# Altium project XBeeLight.PrjPcb
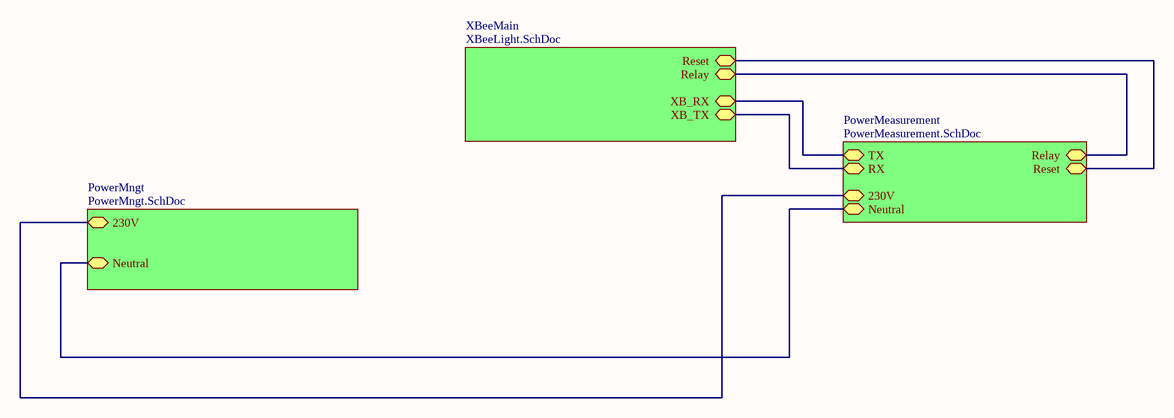
[diagram p0: XBeeCct.SchDoc]
4 sheets, 81 parts. Net scope: hierarchical (ports join the sheet entries above them; power ports are global).
Board file: XBeePCB.PcbDoc
Sheets:
  XBeeCct.SchDoc
    XBeeMain = XBeeLight.SchDoc
    PowerMngt = PowerMngt.SchDoc
    PowerMeasurement = PowerMeasurement.SchDoc

## Sheet XBeeCct.SchDoc
size A

### Sub-sheets
PowerMeasurement = PowerMeasurement.SchDoc: TX, RX, Relay, Reset, 230V, Neutral
PowerMngt = PowerMngt.SchDoc: 230V, Neutral
XBeeMain = XBeeLight.SchDoc: XB_TX, XB_RX, Reset, Relay

### Nets
230V: sheet PowerMngt/230V, sheet PowerMeasurement/230V
Neutral: sheet PowerMngt/Neutral, sheet PowerMeasurement/Neutral
Relay: sheet XBeeMain/Relay, sheet PowerMeasurement/Relay
Reset: sheet XBeeMain/Reset, sheet PowerMeasurement/Reset
RX: sheet XBeeMain/XB_TX, sheet PowerMeasurement/RX
TX: sheet XBeeMain/XB_RX, sheet PowerMeasurement/TX

## Sheet XBeeLight.SchDoc
size A4
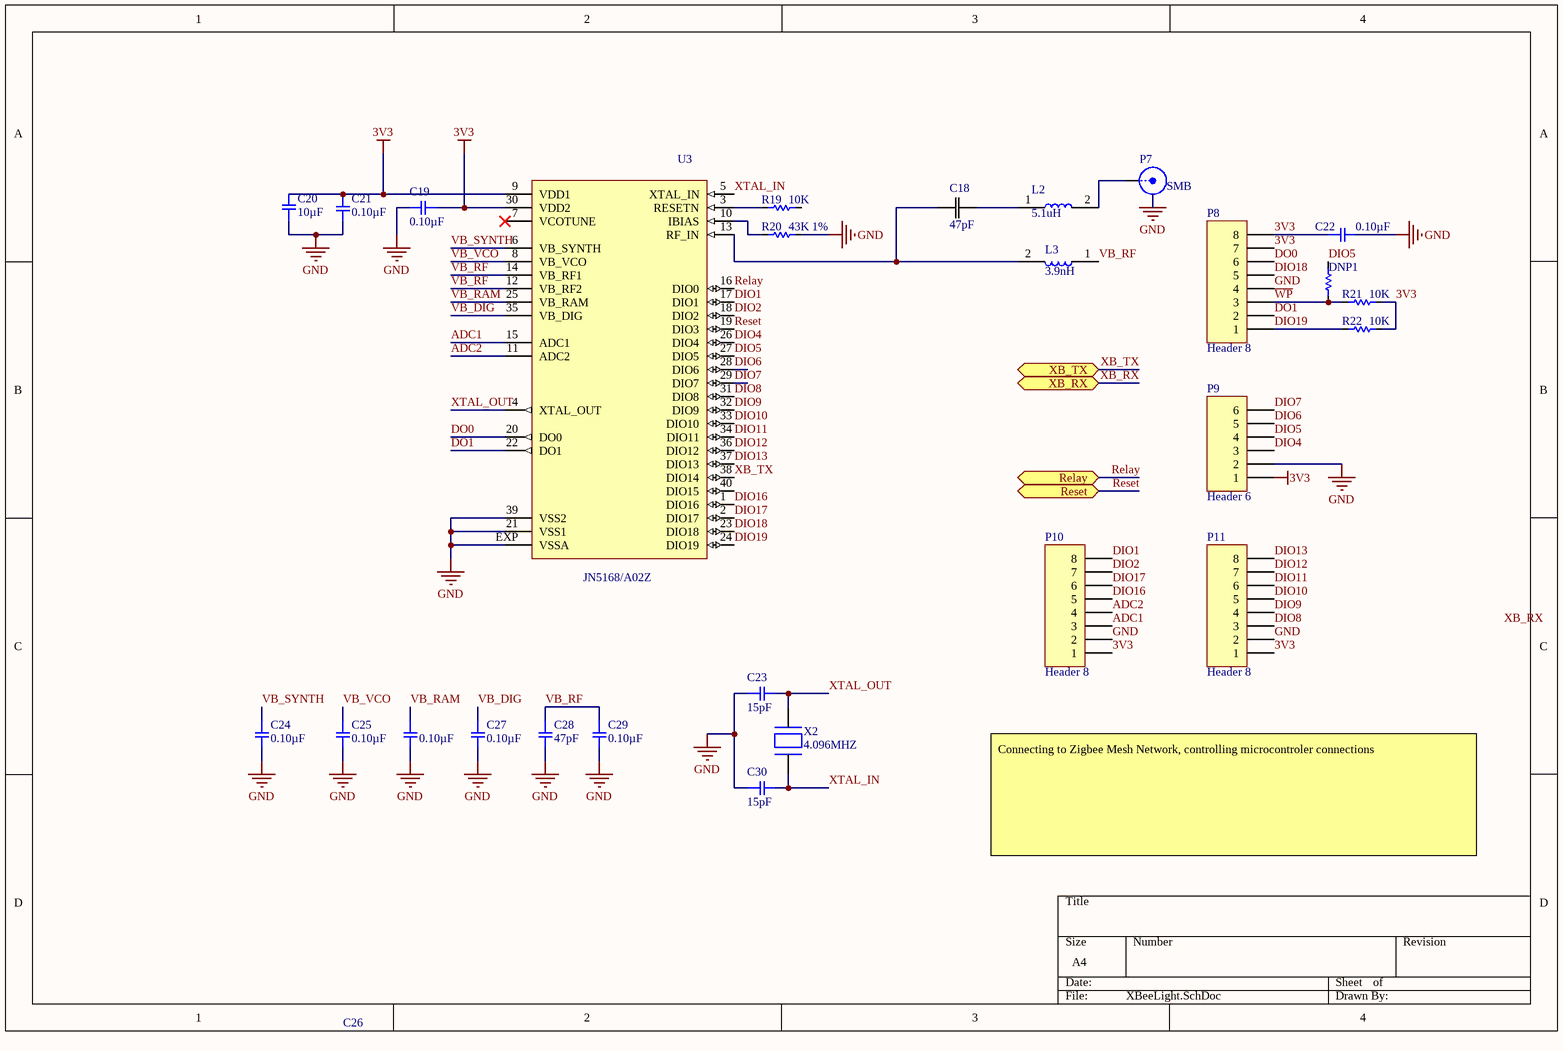
[diagram p1: XBeeLight.SchDoc]

### Parts
C18  47pF  [CC0402N]
C19  0.10µF  [SMD-0402C]
C20  10µF  [SMD-0603C]
C21  0.10µF  [SMD-0402C]
C22  0.10µF  [SMD-0402C]
C23  15pF  [SMD-0402C]
C24  0.10µF  [SMD-0402C]
C25  0.10µF  [SMD-0402C]
C26  0.10µF  [SMD-0402C]
C27  0.10µF  [SMD-0402C]
C28  47pF  [SMD-0402C]
C29  0.10µF  [SMD-0402C]
C30  15pF  [SMD-0402C]
DNP1  10K  [MCS 0402]  (value not drawn)
L2  5.1uH  [INDC1005X45]
L3  3.9nH  [INDC1005X45]
P7  SMB  [SMB_V-RJ45]
P8  Header 8  [HDR1X8]
P9  Header 6  [HDR1X6]
P10  Header 8  [HDR1X8]
P11  Header 8  [HDR1X8]
R19  10K  [MCS 0402]
R20  43K 1%  [RC0402N]
R21  10K  [MCS 0402]
R22  10K  [MCS 0402]
U3  JN5168/A02Z  [QFN50P600X600X100-41N_JN5168/A02Z(Primary)]
X2  4.096MHZ  [XTAL_ABLS2-4.096MHZ-D4Y-T]

### Ports
Relay (bidir), Reset (bidir), XB_RX (bidir), XB_TX (bidir)

### Nets
3V3: C19.1 C20.2 C21.1 C22.1 P8.7 P8.8 P9.1 P10.1 P11.1 R21.2 R22.2 U3.9(VDD1) U3.30(VDD2)
GND: C19.2 C20.1 C21.2 C22.2 C23.1 C24.2 C25.2 C26.2 C27.2 C28.2 C29.2 C30.1 P7.2(Y) P8.4 P9.2 P10.2 P11.2 R20.2 U3.21(VSS1) U3.39(VSS2) U3.EXP(VSSA)
ADC1: P10.3 U3.15(ADC1)
ADC2: P10.4 U3.11(ADC2)
DIO1: P10.8 U3.17(DIO1)
DIO2: P10.7 U3.18(DIO2)
DIO4: P9.3 U3.26(DIO4)
DIO5: DNP1.2 P9.4 U3.27(DIO5)
DIO6: P9.5 U3.28(DIO6)
DIO7: P9.6 U3.29(DIO7)
DIO8: P11.3 U3.31(DIO8)
DIO9: P11.4 U3.32(DIO9)
DIO10: P11.5 U3.33(DIO10)
DIO11: P11.6 U3.34(DIO11)
DIO12: P11.7 U3.36(DIO12)
DIO13: P11.8 U3.37(DIO13)
DIO16: P10.5 U3.1(DIO16)
DIO17: P10.6 U3.2(DIO17)
DIO18: P8.5 U3.23(DIO18)
DIO19: P8.1 R22.1 U3.24(DIO19)
DO0: P8.6 U3.20(DO0)
DO1: P8.2 U3.22(DO1)
Relay: U3.16(DIO0) ; port Relay
Reset: U3.19(DIO3) ; port Reset
VB_DIG: C27.1 U3.35(VB_DIG)
VB_RAM: C26.1 U3.25(VB_RAM)
VB_RF: C28.1 C29.1 L3.1 U3.12(VB_RF2) U3.14(VB_RF1)
VB_SYNTH: C24.1 U3.6(VB_SYNTH)
VB_VCO: C25.1 U3.8(VB_VCO)
~{WP}: DNP1.1 P8.3 R21.1
XB_TX: U3.38(DIO14) ; port XB_TX  [project net RX]
XTAL_IN: C30.2 U3.5(XTAL_IN) X2.1
XTAL_OUT: C23.2 U3.4(XTAL_OUT) X2.2
NetC18_1: C18.1 L2.1
NetC18_2: C18.2 L3.2 U3.13(RF_IN)
NetL2_2: L2.2 P7.1(X)
NetR19_1: R19.1 U3.3(RESETN)
NetR20_1: R20.1 U3.10(IBIAS)

Not connected (* = marked no-connect by the designer): R19 2; U3 7(VCOTUNE)* 40(DIO15)

### Notes on the sheet
- Connecting to Zigbee Mesh Network, controlling microcontroler connections
- Labels drawn without touching a wire or pin: XB_RX

### Library data of the parts
C18 = CC0402JRNPO9BN47: Imported; Manufacturer_Part_Number: CC0402JRNPO9BN470; Vendor: Yageo; Built_By: EMA_UL_Team; Type: DEV; C: Copyright (C) 2015 Accelerated Designs. All rights reserved; RefDes: RefDes; Value: Value
C19 C21 C22 C24-C27 C29 = GCM155R71C104KA55D: CAP CER 0.1UF 16V X7R 0402; Manufacturer: Murata Electronics North America; Factory Stock: 0; Unit Price (USD): 0.1; Minimum Quantity: 1; Tolerance: ±10%; Datasheets: http://www.murata.com/~/media/webrenewal/support/library/catalog/products/capacitor/mlcc/c03e.ashx; Image: //media.digikey.com/Renders/Murata%20Renders/ZRB-SERIES-0402.jpg; Digi-Key Part Number: 490-4759-1-ND; Part Number: GCM155R71C104KA55D; Quantity Available: 734194; @ qty: 0; Packaging: Cut Tape (CT); Series: GCM; Part Status: Active; Value: 0.10µF; Voltage: 16V; Temperature Coefficient: X7R; Operating Temperature: -55°C ~ 125°C; Features: -; Ratings: AEC-Q200; Applications: Automotive; Mounting Type: Surface Mount, MLCC; Package / Case: 0402 (1005 Metric); Size / Dimension: 0.039" L x 0.020" W (1.00mm x 0.50mm); Height - Seated (Max): -; Thickness (Max): 0.022" (0.55mm); Lead Spacing: -; Lead Style: -
C20 = GRM188R60J106KE47D: CAP CER 10UF 6.3V X5R 0603; Manufacturer: Murata Electronics North America; Factory Stock: 0; Unit Price (USD): 0.13; Minimum Quantity: 1; Tolerance: ±10%; Datasheets: http://www.murata.com/~/media/webrenewal/support/library/catalog/products/capacitor/mlcc/c02e.pdf; Image: //media.digikey.com/Renders/Murata%20Renders/ZRB-SERIES-0402.jpg; Digi-Key Part Number: 490-12538-1-ND; Part Number: GRM188R60J106KE47D; Quantity Available: 3805; @ qty: 0; Packaging: Cut Tape (CT); Series: GRM; Part Status: Active; Value: 10µF; Voltage: 6.3V; Temperature Coefficient: X5R; Operating Temperature: -55°C ~ 85°C; Features: -; Ratings: -; Applications: General Purpose; Mounting Type: Surface Mount, MLCC; Package / Case: 0603 (1608 Metric); Size / Dimension: 0.063" L x 0.031" W (1.60mm x 0.80mm); Height - Seated (Max): -; Thickness (Max): 0.035" (0.90mm); Lead Spacing: -; Lead Style: -
C23 C30 = GJM1555C1H150FB01D: CAP CER 15PF 50V NP0 0402; Manufacturer: Murata Electronics North America; Factory Stock: 0; Unit Price (USD): 0.21; Minimum Quantity: 1; Tolerance: ±1%; Temperature Coefficient: C0G, NP0; Datasheets: http://www.murata.com/~/media/webrenewal/support/library/catalog/products/capacitor/mlcc/c02e.pdf; Image: //media.digikey.com/Renders/Murata%20Renders/ZRB-SERIES-0402.jpg; Digi-Key Part Number: 490-11191-1-ND; Part Number: GJM1555C1H150FB01D; Quantity Available: 36038; @ qty: 0; Packaging: Cut Tape (CT); Series: GJM; Part Status: Active; Value: 15pF; Voltage: 50V; Operating Temperature: -55°C ~ 125°C; Features: High Q, Low Loss; Ratings: -; Applications: RF, Microwave, High Frequency; Mounting Type: Surface Mount, MLCC; Package / Case: 0402 (1005 Metric); Size / Dimension: 0.039" L x 0.020" W (1.00mm x 0.50mm); Height - Seated (Max): -; Thickness (Max): 0.022" (0.55mm); Lead Spacing: -; Lead Style: -
C28 = GCM1555C1H470JA16D: CAP CER 47PF 50V NP0 0402; Manufacturer: Murata Electronics North America; Factory Stock: 0; Unit Price (USD): 0.1; Minimum Quantity: 1; Tolerance: ±5%; Temperature Coefficient: C0G, NP0; Datasheets: http://www.murata.com/~/media/webrenewal/support/library/catalog/products/capacitor/mlcc/c03e.ashx; Image: //media.digikey.com/Renders/Murata%20Renders/ZRB-SERIES-0402.jpg; Digi-Key Part Number: 490-10670-1-ND; Part Number: GCM1555C1H470JA16D; Quantity Available: 171; @ qty: 0; Packaging: Cut Tape (CT); Series: GCM; Part Status: Active; Value: 47pF; Voltage: 50V; Operating Temperature: -55°C ~ 125°C; Features: -; Ratings: AEC-Q200; Applications: Automotive; Mounting Type: Surface Mount, MLCC; Package / Case: 0402 (1005 Metric); Size / Dimension: 0.039" L x 0.020" W (1.00mm x 0.50mm); Height - Seated (Max): -; Thickness (Max): 0.022" (0.55mm); Lead Spacing: -; Lead Style: -
DNP1 R19 R21 R22 = 10K Res: Res Thin Film 0402 10K Ohm 0.5% 0.063W(1/16W) ±25ppm/C Molded SMD Automotive Punched T/R; Manufacturer: Panasonic; Manufacturer Part Number: ERA-2AED103X; Resistance: 10 kO; Temp Coefficient: ±25 ppm/°C; Supplier 1: Digi-Key; Stock 1: 99513; Pricing 1: 1=0.22, 10=0.188, 100=0.0735, 1000=0.0308, 2500=0.0282, 5000=0.0256 (USD); Rated Power: 0.063 W; Size Code: 0402; Tolerance (%): ±0.5 %; ComponentLink1URL: https://datasheet.ciiva.com/43470/1776116-43470437.pdf; ComponentLink1Description: https://datasheet.ciiva.com/43470/1776116-43470437.pdf; ComponentLink2URL: https://datasheet.ciiva.com/7830/1776116-7830919.pdf; ComponentLink2Description: https://datasheet.ciiva.com/7830/1776116-7830919.pdf; ComponentLink3URL: https://datasheet.ciiva.com/30240/54aoa0000ce26-30240474.pdf; ComponentLink3Description: https://datasheet.ciiva.com/30240/54aoa0000ce26-30240474.pdf; ComponentLink4URL: https://datasheet.ciiva.com/46378/1776116-46378235.pdf; ComponentLink4Description: https://datasheet.ciiva.com/46378/1776116-46378235.pdf; Supplier Part Number 1: P10KDECT-ND
L2 = LQP15MN5N1B02D: Inductor RF Chip Unshielded Thin Film 5.1nH 0.1nH 500MHz 13Q-Factor Ceramic 140mA 700mOhm DCR 0402 T/R; MF: Murata; Package: 0402 Murata; Digi-Key_Part_Number: 490-6758-1-ND; Digi-Key_Purchase_URL: https://www.digikey.lk/product-detail/en/murata-electronics-north-america/LQP15MN5N1B02D/490-6758-1-ND/3845955?utm_source=snapeda&utm_medium=aggregator&utm_campaign=symbol; SnapEDA_Link: https://www.snapeda.com/parts/LQP15MN5N1B02D/Murata%20Electronics%20North%20America/view-part/?ref=snap; MP: LQP15MN5N1B02D; Value: *
L3 = LQP15MN3N9B02D: FIXED IND 3.9NH 170MA 500 MOHM; Manufacturer: Murata; Product Training Modules: Inductor Products Chip RF Inductors; Catalog Drawings: LQP15M Series Top LQP15M Series Side; Type: Thin Film; Material - Core: Non-Magnetic; Tolerance: ±0.1nH; Shielding: Unshielded; DC Resistance (DCR): 500 mOhm Max; Q @ Freq: 13 @ 500MHz; Frequency - Self Resonant: 6GHz; Frequency - Test: 500MHz; Online Catalog: LQP Series; Other Names: 490-1131-2 / LQP10A3N9B02T1; Supplier 1: Digi-Key; Manufacturer Part Number: LQP15MN3N9B02D; Stock 1: 110804; Pricing 1: 1=0.19, 10=0.173, 100=0.1152, 500=0.096, 1000=0.0807, 2500=0.0691 (USD); Standard Package: 10,000; Category: Inductors, Coils, Chokes; Family: Fixed Inductors; Series: LQP15M; Packaging: Tape & Reel (TR); Inductance: 3.9nH; Current Rating: 170mA; Operating Temperature: -40°C ~ 85°C; Mounting Type: Surface Mount; Package / Case: 0402 (1005 Metric); Size / Dimension: 0.039" L x 0.020" W (1.00mm x 0.50mm); Height - Seated (Max): 0.018" (0.45mm); ComponentLink1URL: http://search.murata.co.jp/Ceramy/image/img/PDF/ENG/L0075S0084LQP15M.pdf; ComponentLink1Description: http://search.murata.co.jp/Ceramy/image/img/PDF/ENG/L0075S0084LQP15M.pdf; ComponentLink2URL: https://www.murata.com/~/media/webrenewal/support/library/catalog/products/inductor/chip/o05e.ashx; ComponentLink2Description: https://www.murata.com/~/media/webrenewal/support/library/catalog/products/inductor/chip/o05e.ashx; ComponentLink3URL: http://www.jameco.com/Jameco/Products/ProdDS/1865137.pdf; ComponentLink3Description: http://www.jameco.com/Jameco/Products/ProdDS/1865137.pdf; ComponentLink4URL: https://www.murata.com/~/media/webrenewal/support/library/catalog/products/inductor/chip/o05e.ashx?la=en-us; ComponentLink4Description: https://www.murata.com/~/media/webrenewal/support/library/catalog/products/inductor/chip/o05e.ashx?la=en-us; ComponentLink5URL: http://uk.rs-online.com/webdocs/0f15/0900766b80f155d9.pdf; ComponentLink5Description: http://uk.rs-online.com/webdocs/0f15/0900766b80f155d9.pdf; Supplier Part Number 1: 490-1131-1-ND
P7 = SMB: SMB Straight Connector; LatestRevisionDate: 17-Jul-2002; LatestRevisionNote: Re-released for DXP Platform.; Publisher: Altium Limited
P8 P10 P11 = Header 8: Header, 8-Pin; LatestRevisionDate: 17-Jul-2002; LatestRevisionNote: Re-released for DXP Platform.; Publisher: Altium Limited
P9 = Header 6: Header, 6-Pin; LatestRevisionDate: 17-Jul-2002; LatestRevisionNote: Re-released for DXP Platform.; Publisher: Altium Limited
R20 = Res 43K: Imported; Manufacturer_Part_Number: ERJ-2RKF4302X; Vendor: Panasonic; Built_By: EMA_UL_Team; C: Copyright (C) 2015 Accelerated Designs. All rights reserved; RefDes: RefDes; Type: DEV; Value: Value
U3 = JN5168/A02Z: JN5168 - ZigBee, RF4CE, JenNet-IP and IEEE802.15.4 wireless microcontroller with 256 kB Flash, 32 kB RAM; MF: NXP Semiconductors; Availability: Unavailable; Price: None; Package: None; SnapEDA_Link: https://www.snapeda.com/parts/JN5168/A02Z/NXP%20Semiconductors/view-part/?ref=snap; MP: JN5168/A02Z; Value: *
X2 = ABLS2-4.096MHZ-D4Y-T: 4.096MHz ±30ppm Crystal 18pF 180 Ohm -40°C ~ 85°C  Surface Mount HC49/US; Manufacturer: Abracon; ESR: 180 ohm; Frequency Stability: ?30 ppm; Frequency Tolerance: ?30; Mode of Oscillation: Fundamental; Product Depth (mm): 4.7 mm; Product Length (mm): 11.4 mm; Screening Level: Industrial; Supplier 1: Digi-Key; Manufacturer Part Number: ABLS2-4.096MHZ-D4Y-T; Stock 1: 6062; Pricing 1: 1=0.46, 10=0.385, 50=0.3466, 100=0.308, 500=0.2926 (USD); Frequency: 4.096 MHz; Load Capacitance: 18 pF; Mounting Style: Surface Mount; Operating Temp Range: -40C to 85C; Package / Case: HC-49/US; Packaging: Tape and Reel; Type: Crystal; ComponentLink1URL: http://www.abracon.com/Resonators/ABLS2.pdf; ComponentLink1Description: http://www.abracon.com/Resonators/ABLS2.pdf; ComponentLink2URL: https://abracon.com/Resonators/ABLS2.pdf; ComponentLink2Description: https://abracon.com/Resonators/ABLS2.pdf; ComponentLink3URL: http://www.farnell.com/datasheets/1749648.pdf; ComponentLink3Description: http://www.farnell.com/datasheets/1749648.pdf; Supplier Part Number 1: 535-9858-1-ND

## Sheet PowerMngt.SchDoc
size A
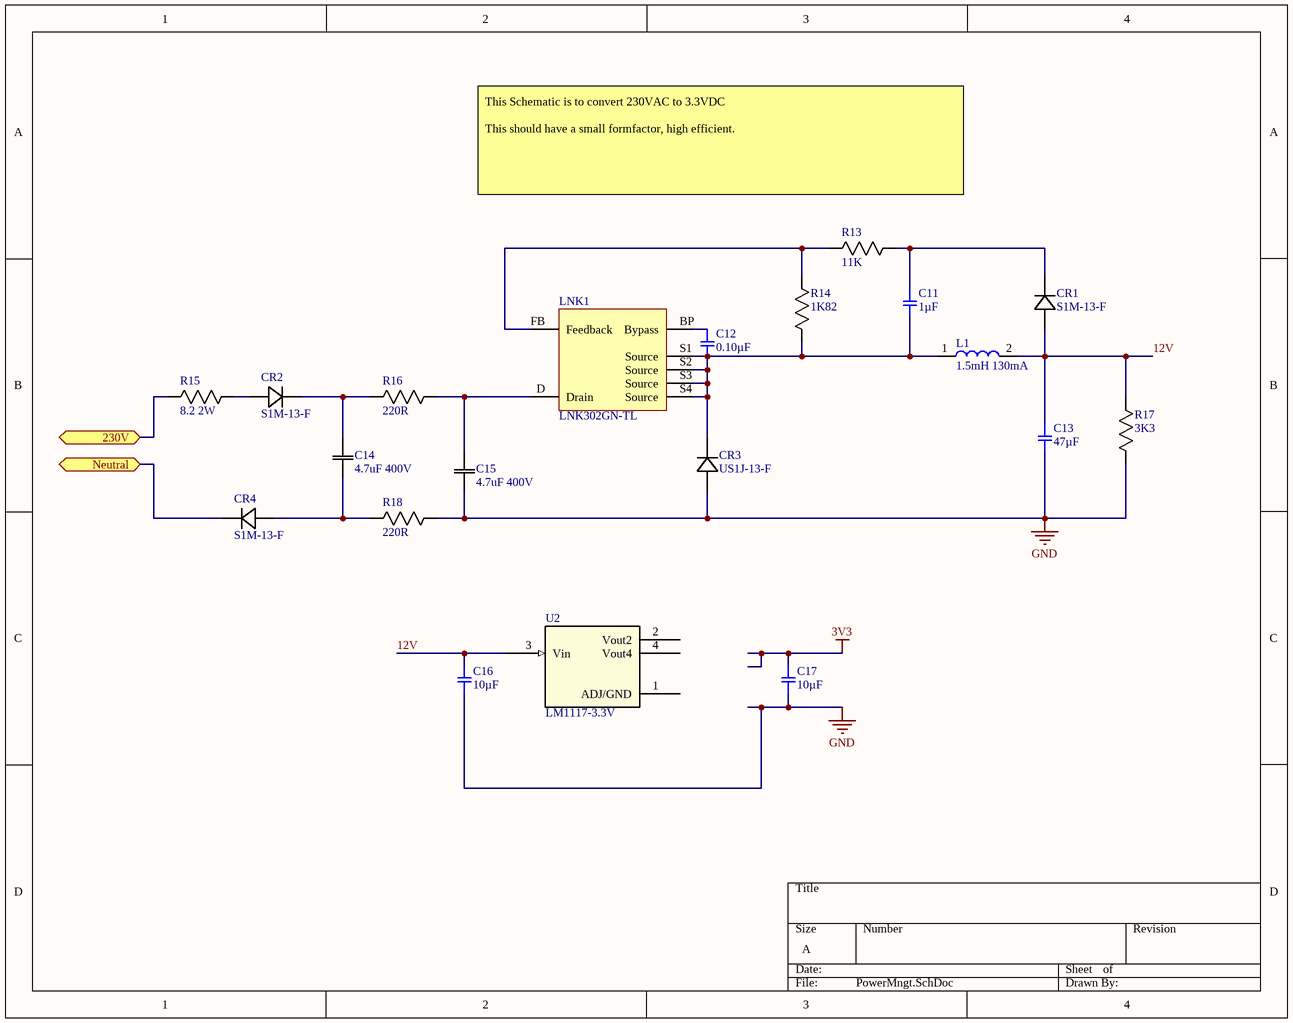
[diagram p2: PowerMngt.SchDoc]

### Parts
C11  1µF  [SMD-0603C]
C12  0.10µF  [SMD-0402C]
C13  47µF  [SMD-1210C]
C14  4.7uF 400V  [CAP_PAN_EEE_G17]
C15  4.7uF 400V  [CAP_PAN_EEE_G17]
C16  10µF  [SMD-0603C]
C17  10µF  [SMD-0603C]
CR1  S1M-13-F  [SMA]
CR2  S1M-13-F  [SMA]
CR3  US1J-13-F  [SMA]
CR4  S1M-13-F  [SMA]
L1  1.5mH 130mA  [AIAP-01]
LNK1  LNK302GN-TL  [SMD-8B]
R13  11K  [RC0805N]
R14  1K82  [RES_ERA6A_0805]
R15  8.2 2W  [RES_SMF2_TYCO]
R16  220R  [RC0805N]
R17  3K3  [RC0805N]
R18  220R  [RC0805N]
U2  LM1117-3.3V  [MP04A]

### Ports
230V (bidir), Neutral (bidir)

### Nets
3V3: C17.2
GND: C13.2 C15.1 C16.1 C17.1 CR3.2 R17.2 R18.1
12V: C13.1 C16.2 CR1.2 L1.2 R17.1 U2.3(Vin)
230V: R15.2 ; port 230V
Neutral: CR4.1 ; port Neutral
NetC11_1: C11.1 CR1.1 R13.1
NetC11_2: C11.2 C12.2 CR3.1 L1.1 LNK1.S1(Source) LNK1.S2(Source) LNK1.S3(Source) LNK1.S4(Source) R14.2
NetC12_1: C12.1 LNK1.BP(Bypass)
NetC14_1: C14.1 CR4.2 R18.2
NetC14_2: C14.2 CR2.1 R16.2
NetC15_2: C15.2 LNK1.D(Drain) R16.1
NetCR2_2: CR2.2 R15.1
NetLNK1_FB: LNK1.FB(Feedback) R13.2 R14.1

Not connected (* = marked no-connect by the designer): U2 1(ADJ/GND) 2(Vout2) 4(Vout4)

### Notes on the sheet
- This Schematic is to convert 230VAC to 3.3VDC
  This should have a small formfactor, high efficient.

### Library data of the parts
C11 = GRM188R61C105MA12D: CAP CER 1UF 16V X5R 0603; Manufacturer: Murata Electronics North America; Factory Stock: 0; Unit Price (USD): 0.1; Minimum Quantity: 1; Tolerance: ±20%; Datasheets: http://www.murata.com/~/media/webrenewal/support/library/catalog/products/capacitor/mlcc/c02e.pdf; Image: //media.digikey.com/Renders/Murata%20Renders/ZRB-SERIES-0402.jpg; Digi-Key Part Number: 490-10480-1-ND; Part Number: GRM188R61C105MA12D; Quantity Available: 3593; @ qty: 0; Packaging: Cut Tape (CT); Series: GRM; Part Status: Active; Value: 1µF; Voltage: 16V; Temperature Coefficient: X5R; Operating Temperature: -55°C ~ 85°C; Features: Derating Recommended; Ratings: -; Applications: General Purpose; Mounting Type: Surface Mount, MLCC; Package / Case: 0603 (1608 Metric); Size / Dimension: 0.063" L x 0.031" W (1.60mm x 0.80mm); Height - Seated (Max): -; Thickness (Max): 0.035" (0.90mm); Lead Spacing: -; Lead Style: -
C12 = GCM155R71C104KA55D: as C19 on sheet XBeeLight; Datasheets: http://www.murata.com/~/media/webrenewal/support/library/catalog/products/capacitor/mlcc/c03e.ashx; Image: //media.digikey.com/Renders/Murata%20Renders/ZRB-SERIES-0402.jpg; Digi-Key Part Number: 490-4759-1-ND; Part Number: GCM155R71C104KA55D; Quantity Available: 734194; @ qty: 0; Packaging: Cut Tape (CT); Series: GCM; Part Status: Active; Value: 0.10µF; Voltage: 16V; Temperature Coefficient: X7R; Operating Temperature: -55°C ~ 125°C; Features: -; Ratings: AEC-Q200; Applications: Automotive; Mounting Type: Surface Mount, MLCC; Package / Case: 0402 (1005 Metric); Size / Dimension: 0.039" L x 0.020" W (1.00mm x 0.50mm); Height - Seated (Max): -; Thickness (Max): 0.022" (0.55mm); Lead Spacing: -; Lead Style: -
C13 = GRM32EC81C476KE15L: CAP CER 47UF 16V X6S 1210; Manufacturer: Murata Electronics North America; Factory Stock: 0; Unit Price (USD): 0.73; Minimum Quantity: 1; Tolerance: ±10%; Datasheets: http://www.murata.com/~/media/webrenewal/support/library/catalog/products/capacitor/mlcc/c02e.pdf; Image: //media.digikey.com/Renders/Murata%20Renders/1210-32E.jpg; Digi-Key Part Number: 490-10531-1-ND; Part Number: GRM32EC81C476KE15L; Quantity Available: 396; @ qty: 0; Packaging: Cut Tape (CT); Series: GRM; Part Status: Active; Value: 47µF; Voltage: 16V; Temperature Coefficient: X6S; Operating Temperature: -55°C ~ 105°C; Features: Derating Recommended; Ratings: -; Applications: General Purpose; Failure Rate: Surface Mount, MLCC; Mounting Type: 1210 (3225 Metric); Package / Case: 0.126" L x 0.098" W (3.20mm x 2.50mm); Size / Dimension: -; Height - Seated (Max): 0.106" (2.70mm); Thickness (Max): -; Lead Spacing: -
C14 C15 = EEV-EB2G4R7Q: Imported; Vendor: Panasonic; Built_By: EMA_UL_Team; Type: DEV; C: Copyright (C) 2015 Accelerated Designs. All rights reserved; Manufacturer_Part_Number: EEV-EB2G4R7Q; RefDes: RefDes; Value: Value
C16 C17 = GRM188R60J106KE47D: as C20 on sheet XBeeLight; Datasheets: http://www.murata.com/~/media/webrenewal/support/library/catalog/products/capacitor/mlcc/c02e.pdf; Image: //media.digikey.com/Renders/Murata%20Renders/ZRB-SERIES-0402.jpg; Digi-Key Part Number: 490-12538-1-ND; Part Number: GRM188R60J106KE47D; Quantity Available: 3805; @ qty: 0; Packaging: Cut Tape (CT); Series: GRM; Part Status: Active; Value: 10µF; Voltage: 6.3V; Temperature Coefficient: X5R; Operating Temperature: -55°C ~ 85°C; Features: -; Ratings: -; Applications: General Purpose; Mounting Type: Surface Mount, MLCC; Package / Case: 0603 (1608 Metric); Size / Dimension: 0.063" L x 0.031" W (1.60mm x 0.80mm); Height - Seated (Max): -; Thickness (Max): 0.035" (0.90mm); Lead Spacing: -; Lead Style: -
CR1 CR2 CR4 = S1M-13-F: Imported; Vendor: Diodes Inc; Built_By: EMA_UL_Team; Type: DEV; C: Copyright (C) 2015 Accelerated Designs. All rights reserved; Manufacturer_Part_Number: S1M-13-F; RefDes: RefDes; Value: Value
CR3 = US1J-13-F: Imported; Vendor: Diodes Inc; Built_By: EMA_UL_Team; Type: DEV; C: Copyright (C) 2015 Accelerated Designs. All rights reserved; Manufacturer_Part_Number: US1J-13-F; RefDes: RefDes; Value: Value
L1 = AIAP-01-152K-T: Imported; Built_By: EMA_UL_Team; Vendor: Abracon; Type: DEV; Manufacturer_Part_Number: AIAP-01-152K-T; RefDes: RefDes; Value: Value
LNK1 = LNK302GN-TL: IC OFFLINE SWIT OCP 8SMD; Manufacturer: Power Integrations; Dynamic Catalog: AC DC Converters, Offline Switchers; Power (Watts): 12mW; Reference Design Library: DER-092: 4 LEDs @ 40mA, 0.5W, 85 ~ 265VAC in; Output Isolation: Non-Isolated; Frequency Range: 62kHz ~ 70kHz; Voltage - Breakdown: 700V; Other Names: 596-1020-2 / LNK302GNTL; Supplier 1: Digi-Key; Supplier Part Number 1: 596-1020-1-ND; Manufacturer Part Number: LNK302GN-TL; Stock 1: 53740; Pricing 1: 1=1.35, 10=1.193, 25=1.0776, 100=0.9428, 250=0.8273, 500=0.7311 (USD); Standard Package: 1,000; Category: Integrated Circuits (ICs); Family: PMIC - AC DC Converters, Offline Switchers; Series: LinkSwitch®-TN; Packaging: Tape & Reel (TR); Voltage - Input: -; Voltage - Output: -; Operating Temperature: -40°C ~ 150°C; Package / Case: 8-SMD (7 Leads), Gull Wing; Supplier Device Package: SMD-8B; Online Catalog: AC DC Converters, Offline Switchers; ComponentLink1URL: http://www.powerint.com/sites/default/files/product-docs/lnk302_304-306.pdf; ComponentLink1Description: http://www.powerint.com/sites/default/files/product-docs/lnk302_304-306.pdf; ComponentLink2URL: https://www.power.com/sites/default/files/product-docs/lnk302_304-306.pdf; ComponentLink2Description: https://www.power.com/sites/default/files/product-docs/lnk302_304-306.pdf; ComponentLink3URL: http://www.power.com/sites/default/files/product-docs/lnk302_304-306.pdf; ComponentLink3Description: http://www.power.com/sites/default/files/product-docs/lnk302_304-306.pdf
R13 = ERA-6AEB113V: Imported; Vendor: Panasonic; Built_By: EMA_UL_Team; C: Copyright (C) 2015 Accelerated Designs. All rights reserved; Manufacturer_Part_Number: ERA-6AEB113V; RefDes: RefDes; Type: DEV; Value: Value
R14 = ERA-6AEB1821V: Imported; Vendor: Panasonic; Built_By: EMA_UL_Team; C: Copyright (C) 2015 Accelerated Designs. All rights reserved; Manufacturer_Part_Number: ERA-6AEB1821V; RefDes: RefDes; Type: DEV; Value: Value
R15 = SMW28R2JT: Imported; Vendor: TE Connectivity; Built_By: EMA_UL_Team; C: Copyright (C) 2015 Accelerated Designs. All rights reserved; Manufacturer_Part_Number: SMW28R2JT; RefDes: RefDes; Type: DEV; Value: Value
R16 R18 = ERJ-P06J221V: Imported; Vendor: Panasonic; Built_By: EMA_UL_Team; C: Copyright (C) 2015 Accelerated Designs. All rights reserved; Manufacturer_Part_Number: ERJ-P06J221V; RefDes: RefDes; Type: DEV; Value: Value
R17 = ERA-6AEB332V: Imported; Vendor: Panasonic; Built_By: EMA_UL_Team; C: Copyright (C) 2015 Accelerated Designs. All rights reserved; Manufacturer_Part_Number: ERA-6AEB332V; RefDes: RefDes; Type: DEV; Value: Value
U2 = LM1117MPX-3.3/NO: Imported; Manufacturer_Part_Number: LM1117MPX-3.3/NOPB; Built_By: EMA_UL_Team; Vendor: National Semiconductor; RefDes: RefDes; Type: DEV; Value: Value

## Sheet PowerMeasurement.SchDoc
size A
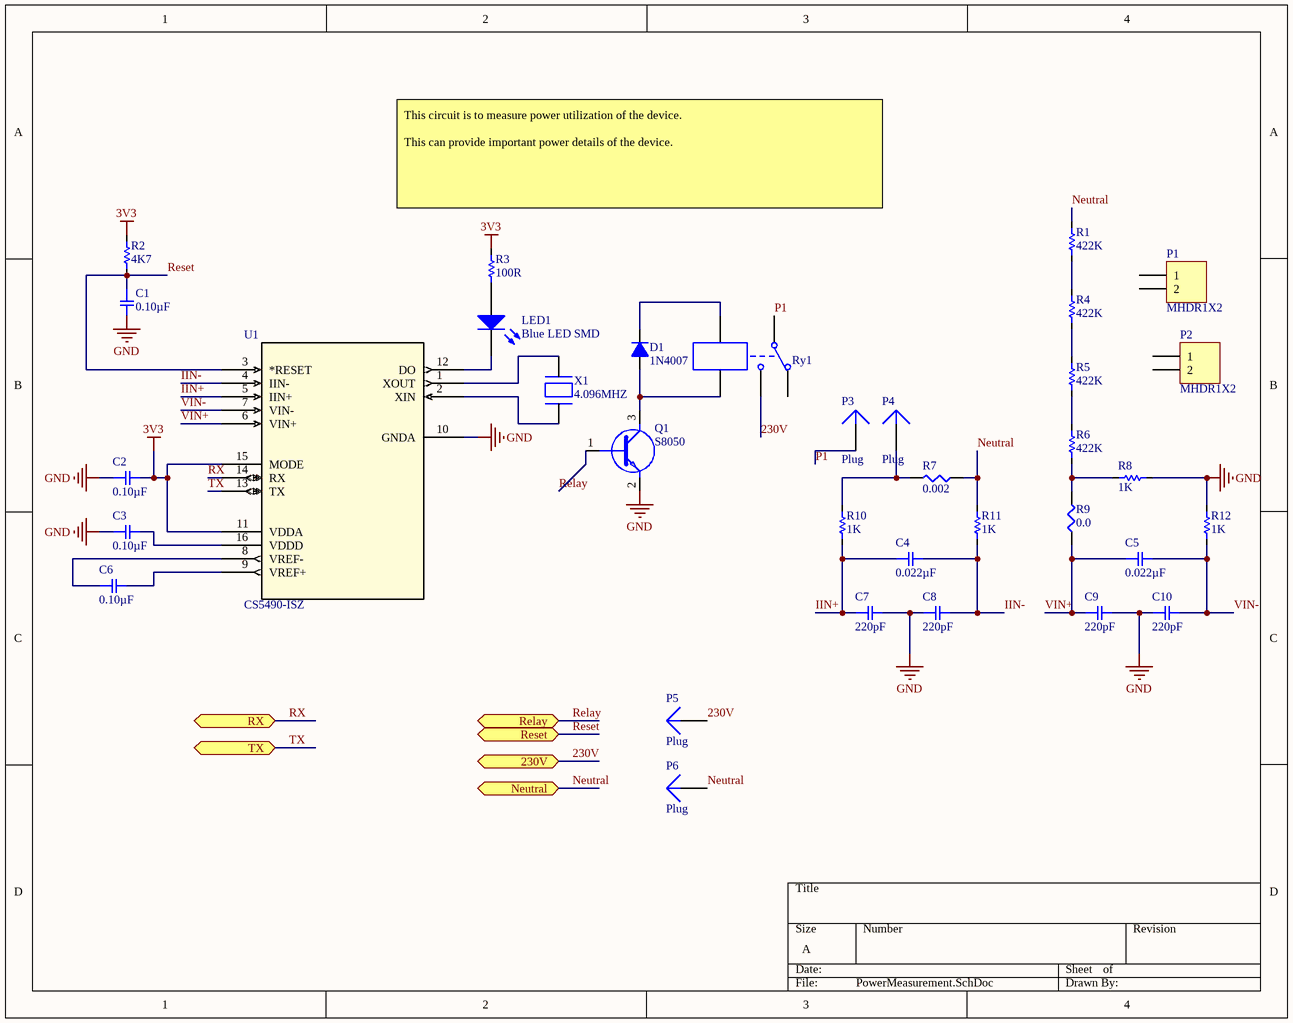
[diagram p3: PowerMeasurement.SchDoc]

### Parts
C1  0.10µF  [SMD-0402C]
C2  0.10µF  [SMD-0402C]
C3  0.10µF  [SMD-0402C]
C4  0.022µF  [SMD-0402C]
C5  0.022µF  [SMD-0402C]
C6  0.10µF  [SMD-0402C]
C7  220pF  [SMD-0402C]
C8  220pF  [SMD-0402C]
C9  220pF  [SMD-0402C]
C10  220pF  [SMD-0402C]
D1  1N4007  [D2A]
LED1  Blue LED SMD  [1206 Blue LED SMD]
P1  MHDR1X2  [MHDR1X2]
P2  MHDR1X2  [MHDR1X2]
P3  Plug  [PIN1]
P4  Plug  [PIN1]
P5  Plug  [PIN1]
P6  Plug  [PIN1]
Q1  S8050  [SI2305TP]
R1  422K  [MCS 0402]
R2  4K7  [MCS 0402]
R3  100R  [MCS 0402]
R4  422K  [MCS 0402]
R5  422K  [MCS 0402]
R6  422K  [MCS 0402]
R7  0.002  [SMD-2512-RES]
R8  1K  [MCS 0402]
R9  0.0  [SMD-0402-RES]
R10  1K  [MCS 0402]
R11  1K  [MCS 0402]
R12  1K  [MCS 0402]
Ry1  Relay  [SRD-05VDC-SL-C]  (value not drawn)
U1  CS5490-ISZ  [CIR-SOIC-16_W150]
X1  4.096MHZ  [XTAL_ABLS2-4.096MHZ-D4Y-T]

### Ports
230V (bidir), Neutral (bidir), Relay (bidir), Reset (bidir), RX (bidir), TX (bidir)

### Nets
3V3: C2.2 R2.2 R3.2 U1.11(VDDA) U1.15(MODE)
GND: C1.2 C2.1 C3.1 C7.2 C8.1 C9.2 C10.1 Q1.2(E) R8.1 R12.2 U1.10(GNDA)
230V: P5.1 Ry1.5 ; port 230V
IIN+: C4.1 C7.1 R10.1 U1.5(IIN+)
IIN-: C4.2 C8.2 R11.1 U1.4(IIN-)
Neutral: P6.1 R1.2 R7.1 R11.2 ; port Neutral
P1: P3.1 Ry1.4
Relay: Q1.1(B) ; port Relay
Reset: C1.1 R2.1 U1.3(*RESET) ; port Reset
RX: U1.14(RX) ; port RX
TX: U1.13(TX) ; port TX
VIN+: C5.1 C9.1 R9.1 U1.6(VIN+)
VIN-: C5.2 C10.2 R12.1 U1.7(VIN-)
NetC3_2: C3.2 U1.16(VDDD)
NetC6_1: C6.1 U1.8(VREF-)
NetC6_2: C6.2 U1.9(VREF+)
NetD1_1: D1.1(A) Q1.3(C) Ry1.2
NetD1_2: D1.2(K) Ry1.1
NetLED1_1: LED1.1(A) R3.1
NetLED1_2: LED1.2(K) U1.12(DO)
NetP4_1: P4.1 R7.2 R10.2
NetR1_1: R1.1 R4.2
NetR4_1: R4.1 R5.2
NetR5_1: R5.1 R6.2
NetR6_1: R6.1 R8.2 R9.2
NetU1_1: U1.1(XOUT) X1.2
NetU1_2: U1.2(XIN) X1.1

Not connected (* = marked no-connect by the designer): P1 1 2; P2 1 2; Ry1 3

### Notes on the sheet
- (near R3) This circuit is to measure power utilization of the device.
  This can provide important power details of the device.

### Library data of the parts
C1-C3 C6 = GCM155R71C104KA55D: as C19 on sheet XBeeLight; Datasheets: http://www.murata.com/~/media/webrenewal/support/library/catalog/products/capacitor/mlcc/c03e.ashx; Image: //media.digikey.com/Renders/Murata%20Renders/ZRB-SERIES-0402.jpg; Digi-Key Part Number: 490-4759-1-ND; Part Number: GCM155R71C104KA55D; Quantity Available: 734194; @ qty: 0; Packaging: Cut Tape (CT); Series: GCM; Part Status: Active; Value: 0.10µF; Voltage: 16V; Temperature Coefficient: X7R; Operating Temperature: -55°C ~ 125°C; Features: -; Ratings: AEC-Q200; Applications: Automotive; Mounting Type: Surface Mount, MLCC; Package / Case: 0402 (1005 Metric); Size / Dimension: 0.039" L x 0.020" W (1.00mm x 0.50mm); Height - Seated (Max): -; Thickness (Max): 0.022" (0.55mm); Lead Spacing: -; Lead Style: -
C4 C5 = GCM155R71H223KA55D: CAP CER 0.022UF 50V X7R 0402; Manufacturer: Murata Electronics North America; Factory Stock: 0; Unit Price (USD): 0.1; Minimum Quantity: 1; Tolerance: ±10%; Datasheets: http://www.murata.com/~/media/webrenewal/support/library/catalog/products/capacitor/mlcc/c03e.ashx; Image: //media.digikey.com/Renders/Murata%20Renders/ZRB-SERIES-0402.jpg; Digi-Key Part Number: 490-4763-1-ND; Part Number: GCM155R71H223KA55D; Quantity Available: 203538; @ qty: 0; Packaging: Cut Tape (CT); Series: GCM; Part Status: Active; Value: 0.022µF; Voltage: 50V; Temperature Coefficient: X7R; Operating Temperature: -55°C ~ 125°C; Features: -; Ratings: AEC-Q200; Applications: Automotive; Mounting Type: Surface Mount, MLCC; Package / Case: 0402 (1005 Metric); Size / Dimension: 0.039" L x 0.020" W (1.00mm x 0.50mm); Height - Seated (Max): -; Thickness (Max): 0.022" (0.55mm); Lead Spacing: -; Lead Style: -
C7-C10 = GCM1555C1H221JA16D: CAP CER 220PF 50V NP0 0402; Manufacturer: Murata Electronics North America; Factory Stock: 0; Unit Price (USD): 0.1; Minimum Quantity: 1; Tolerance: ±5%; Temperature Coefficient: C0G, NP0; Datasheets: http://www.murata.com/~/media/webrenewal/support/library/catalog/products/capacitor/mlcc/c03e.ashx; Image: //media.digikey.com/Renders/Murata%20Renders/ZRB-SERIES-0402.jpg; Digi-Key Part Number: 490-4927-1-ND; Part Number: GCM1555C1H221JA16D; Quantity Available: 20733; @ qty: 0; Packaging: Cut Tape (CT); Series: GCM; Part Status: Active; Value: 220pF; Voltage: 50V; Operating Temperature: -55°C ~ 125°C; Features: -; Ratings: AEC-Q200; Applications: Automotive; Mounting Type: Surface Mount, MLCC; Package / Case: 0402 (1005 Metric); Size / Dimension: 0.039" L x 0.020" W (1.00mm x 0.50mm); Height - Seated (Max): -; Thickness (Max): 0.022" (0.55mm); Lead Spacing: -; Lead Style: -
D1 = 1N4007: Diode 1A; Value: 1N4007
LED1 = Blue LED SMD: Latest Reviewer: Zion Blue; Category: LED; Mounting Technology: Surface Mount; LatestRevisionNote: Footprint Corrections; LatestRevisionDate: 21-Jun-2014; Publisher: Cynetik Group
P1 P2 = MHDR1X2: Header, 2-Pin; LatestRevisionDate: 17-Jul-2002; LatestRevisionNote: Re-released for DXP Platform.; Publisher: Altium Limited
Q1 = MMSS8050-H-TP: TRANS NPN 25V 1.5A SOT23; Manufacturer: MCC; Vce Saturation (Max) @ Ib, Ic: 500mV @ 80mA, 800mA; Current - Collector Cutoff (Max): 100nA; DC Current Gain (hFE) (Min) @ Ic, Vce: 120 @ 100mA, 1V; Power - Max: 625mW; Frequency - Transition: 100MHz; Online Catalog: NPN Transistors; Other Names: MMSS8050-H-TP-ND MMSS8050-H-TPMSTR MMSS8050HTP Q6289485; Supplier 1: Digi-Key; Manufacturer Part Number: MMSS8050-H-TP; Stock 1: 2136; Pricing 1: 1=0.21, 10=0.19, 25=0.1728, 100=0.1246, 250=0.0734, 500=0.0609, 1000=0.0415 (USD); Standard Package: 3,000; Category: Discrete Semiconductor Products; Family: Transistors (BJT) - Single; Series: -; Packaging: Tape & Reel (TR); Transistor Type: NPN; Current - Collector (Ic) (Max): 1.5A; Voltage - Collector Emitter Breakdown (Max): 25V; Mounting Type: Surface Mount; Package / Case: TO-236-3, SC-59, SOT-23-3; Supplier Device Package: SOT-23; ComponentLink1URL: http://www.mouser.com/ds/2/258/MMSS8050-255048.pdf; ComponentLink1Description: http://www.mouser.com/ds/2/258/MMSS8050-255048.pdf; ComponentLink2URL: http://www.mccsemi.com/up_pdf/MMSS8050(SOT-23).pdf; ComponentLink2Description: http://www.mccsemi.com/up_pdf/MMSS8050(SOT-23).pdf; Supplier Part Number 1: MMSS8050-H-TPMSCT-ND
R1 R4-R6 = 422K: RESISTOR, THICK FILM, 422KOHM, 100mW, ± 1%; Manufacturer: Panasonic; Manufacturer Part Number: ERJ-2RKF4223X; EDA / CAD Models: Download from Accelerated Designs; Power (Watts): 0.1W, 1/10W; Temperature Coefficient: ±100ppm/°C; Online Catalog: ERJ Series; Kits: RSM5L-ND  - RES KIT 100K-1M 1/10W 4850PCS; Other Names: ERJ-2RKF4223 ERJ2RKF4223 P422KLCT; Supplier 1: Digi-Key; Stock 1: 90880; Pricing 1: 1=0.1, 10=0.045, 100=0.0183, 1000=0.0082, 2500=0.0072, 5000=0.0059 (USD); Standard Package: 1; Category: Resistors; Family: Chip Resistor - Surface Mount; Series: ERJ; Packaging: Cut Tape (CT); Resistance (Ohms): 422k; Tolerance: ±1%; Composition: Thick Film; Features: Automotive AEC-Q200; Operating Temperature: -55°C ~ 155°C; Package / Case: 0402 (1005 Metric); Supplier Device Package: 0402; Size / Dimension: 0.039" L x 0.020" W (1.00mm x 0.50mm); Height: 0.016" (0.40mm); Number of Terminations: 2; ComponentLink1URL: http://www.farnell.com/datasheets/1678782.pdf; ComponentLink1Description: http://www.farnell.com/datasheets/1678782.pdf; ComponentLink2URL: http://industrial.panasonic.com/www-data/pdf/AOA0000/AOA0000CE2.pdf; ComponentLink2Description: http://industrial.panasonic.com/www-data/pdf/AOA0000/AOA0000CE2.pdf; ComponentLink3URL: http://www.mouser.com/ds/2/315/AOA0000C283-1093288.pdf; ComponentLink3Description: http://www.mouser.com/ds/2/315/AOA0000C283-1093288.pdf; Supplier Part Number 1: P422KLCT-ND
R2 = 4K7 Res: Panasonic ERA Series Thin Film Surface Mount Resistor 0402 Case 4.7k 0.1% 0.063W 25ppm/C; Manufacturer Part Number: ERA-2AEB472X; Resistance: 4.7 kO; Temp Coefficient: ±25 ppm/°C; Supplier 1: Digi-Key; Manufacturer: Panasonic; Stock 1: 111513; Pricing 1: 1=0.43, 10=0.326, 100=0.137, 1000=0.0756, 2500=0.0709, 5000=0.0652 (USD); Rated Power: 0.063 W; Size Code: 0402; Tolerance (%): ±0.1 %; ComponentLink1URL: https://datasheet.ciiva.com/11811/0900766b80beefcc-11811886.pdf; ComponentLink1Description: https://datasheet.ciiva.com/11811/0900766b80beefcc-11811886.pdf; ComponentLink2URL: https://datasheet.ciiva.com/22640/328837-22640615.pdf; ComponentLink2Description: https://datasheet.ciiva.com/22640/328837-22640615.pdf; ComponentLink3URL: https://datasheet.ciiva.com/24023/aoa0000ce26-197354-24023865.pdf; ComponentLink3Description: https://datasheet.ciiva.com/24023/aoa0000ce26-197354-24023865.pdf; ComponentLink4URL: https://datasheet.ciiva.com/46399/328837-46399002.pdf; ComponentLink4Description: https://datasheet.ciiva.com/46399/328837-46399002.pdf; ComponentLink5URL: https://datasheet.ciiva.com/22743/1776116-22743051.pdf; ComponentLink5Description: https://datasheet.ciiva.com/22743/1776116-22743051.pdf; ComponentLink6URL: https://datasheet.ciiva.com/9117/aoa0000ce26-9117420.pdf; ComponentLink6Description: https://datasheet.ciiva.com/9117/aoa0000ce26-9117420.pdf; ComponentLink7URL: https://datasheet.ciiva.com/16759/70068849-16759180.pdf; ComponentLink7Description: https://datasheet.ciiva.com/16759/70068849-16759180.pdf; ComponentLink8URL: https://datasheet.ciiva.com/9117/aoa0000ce26-9117423.pdf; ComponentLink8Description: https://datasheet.ciiva.com/9117/aoa0000ce26-9117423.pdf; ComponentLink9URL: https://datasheet.ciiva.com/16395/aoa0000ce26-16395247.pdf; ComponentLink9Description: https://datasheet.ciiva.com/16395/aoa0000ce26-16395247.pdf; ComponentLink10URL: https://datasheet.ciiva.com/25723/1776116-25723855.pdf; ComponentLink10Description: https://datasheet.ciiva.com/25723/1776116-25723855.pdf; Supplier Part Number 1: P4.7KDCCT-ND
R3 = 100R: Res Thin Film 0402 100 Ohm 0.5% 0.063W(1/16W) ±25ppm/C Molded SMD Automotive Punched T/R; Manufacturer: Panasonic; Manufacturer Part Number: ERA-2AED101X; Featured Product: ERA-xA Metal/Thin Film Chip Resistors Hot New Technologies Wearables Technology Components; EDA / CAD Models: Download from Accelerated Designs; Resistance (Ohms): 100; Power (Watts): 0.063W, 1/16W; Temperature Coefficient: ±25ppm/°C; Online Catalog: ERA-2A Series; Other Names: P100DEDKR; Supplier 1: Digi-Key; Stock 1: 25171; Pricing 1: 1=0.22, 10=0.188, 100=0.0735, 1000=0.0308, 2500=0.0282, 5000=0.0256 (USD); Standard Package: 1; Category: Resistors; Family: Chip Resistor - Surface Mount; Series: ERA-2A; Packaging: Digi-Reel®; Tolerance: ±0.5%; Composition: Thin Film; Features: Automotive AEC-Q200; Operating Temperature: -55°C ~ 155°C; Package / Case: 0402 (1005 Metric); Supplier Device Package: 0402; Size / Dimension: 0.039" L x 0.020" W (1.00mm x 0.50mm); Height: 0.016" (0.40mm); Number of Terminations: 2; ComponentLink1URL: http://www.mouser.com/ds/2/315/AOA0000C237-1100991.pdf; ComponentLink1Description: http://www.mouser.com/ds/2/315/AOA0000C237-1100991.pdf; ComponentLink2URL: http://www.farnell.com/datasheets/1776116.pdf; ComponentLink2Description: http://www.farnell.com/datasheets/1776116.pdf; ComponentLink3URL: http://industrial.panasonic.com/www-data/pdf/AOA0000/AOA0000CE26.pdf; ComponentLink3Description: http://industrial.panasonic.com/www-data/pdf/AOA0000/AOA0000CE26.pdf; Supplier Part Number 1: P100DECT-ND
R7 = ERJ-MP4PF2M0U: RES SMD 0.002 OHM 1% 2W 2512; Manufacturer: Panasonic Electronic Components; Factory Stock: 0; Unit Price (USD): 0.22038; @ qty: 1500; Minimum Quantity: 1; Temperature Coefficient: ±75ppm/°C; Part Number: ERJ-MP4PF2M0U; Datasheets: https://industrial.panasonic.com/cdbs/www-data/pdf/RDA0000/AOA0000C263.pdf; Image: //media.digikey.com/Photos/Panasonic%20Elect%20Works%20Photos/MFG_ERJ-MS4.jpg; Digi-Key Part Number: P19407CT-ND; Quantity Available: 1991; Packaging: Cut Tape (CT); Series: ERJ; Part Status: Active; Value: 0.002; Tolerance: ±1%; Power (Watts): 2W; Composition: Metal Element; Features: Automotive AEC-Q200, Current Sense, Moisture Resistant; Operating Temperature: -65°C ~ 170°C; Package / Case: 2512 (6432 Metric); Supplier Device Package: 2512; Size / Dimension: 0.252" L x 0.126" W (6.40mm x 3.20mm); Height - Seated (Max): 0.035" (0.89mm); Number of Terminations: 2; Failure Rate: -
R8 R10-R12 = 1K Res: RES SMD 1K OHM 5% 1/32W 01005; Manufacturer: Panasonic; Manufacturer Part Number: ERJ-XGNJ102Y; Resistance: 1 kOhms; Power Rating: 31 mW; Temperature Coefficient: 200 PPM / C; Voltage Rating: 15 V; Case Height: 0.13 mm; Case Length: 0.4 mm; Case Width: 0.2 mm; Supplier 1: Digi-Key; Stock 1: 104433; Pricing 1: 1=0.4, 10=0.335, 100=0.131, 1000=0.0548, 2500=0.0503, 5000=0.0457 (USD); Product Category: Thick Film Resistors - SMD; RoHS: Details; Tolerance: 5 %; Case Code - in: 01005; Case Code - mm: 0402; Operating Temperature Range: - 55 C to + 125 C; Brand: Panasonic; Package / Case: 01005 (0402 metric); Packaging: Reel; Product: Thick Film Resistors SMD; Series: ERJ; Factory Pack Quantity: 20000; Type: Thick Film Resistors SMD; ComponentLink1URL: https://datasheet.ciiva.com/9199/aoa0000ce1-9199077.pdf; ComponentLink1Description: https://datasheet.ciiva.com/9199/aoa0000ce1-9199077.pdf; ComponentLink2URL: https://datasheet.ciiva.com/6544/erjxgn-6544006.pdf; ComponentLink2Description: https://datasheet.ciiva.com/6544/erjxgn-6544006.pdf; ComponentLink3URL: https://datasheet.ciiva.com/17215/aoa0000ce1-17215353.pdf; ComponentLink3Description: https://datasheet.ciiva.com/17215/aoa0000ce1-17215353.pdf; ComponentLink4URL: https://datasheet.ciiva.com/6544/erjxgn-6544011.pdf; ComponentLink4Description: https://datasheet.ciiva.com/6544/erjxgn-6544011.pdf; ComponentLink5URL: https://datasheet.ciiva.com/30174/4aoa0000ce1-30174159.pdf; ComponentLink5Description: https://datasheet.ciiva.com/30174/4aoa0000ce1-30174159.pdf; Supplier Part Number 1: P1.0KAWCT-ND
R9 = ERJ-2GE0R00X: RES SMD 0.0OHM JUMPER 1/10W 0402; Manufacturer: Panasonic Electronic Components; Factory Stock: 0; Unit Price (USD): 0.00384; @ qty: 1500; Minimum Quantity: 1; Power (Watts): 0.1W, 1/10W; Part Number: ERJ-2GE0R00X; Datasheets: http://industrial.panasonic.com/www-cgi/jvcr13pz.cgi?E+PZ+3+AOA0001+ERJ2GE0R00X+7+WW; Image: //media.digikey.com/Photos/Panasonic%20Photos/ERJ-PA2-Series.jpg; Digi-Key Part Number: P0.0JCT-ND; Quantity Available: 3152483; Packaging: Cut Tape (CT); Series: ERJ; Part Status: Active; Value: 0.0; Tolerance: Jumper; Composition: Thick Film; Features: Automotive AEC-Q200; Temperature Coefficient: -; Operating Temperature: -55°C ~ 155°C; Package / Case: 0402 (1005 Metric); Supplier Device Package: 0402; Size / Dimension: 0.039" L x 0.020" W (1.00mm x 0.50mm); Height - Seated (Max): 0.016" (0.40mm); Number of Terminations: 2; Failure Rate: -
Ry1 = SRD-05VDC-SL-C: Songle Relay; LatestReviewer: Evan Green; Published: 02-Apr-2015; LatestRevisionDate: 02-Apr-2015; LatestRevisionNote: Component Created; Publisher: Cynetik Group
U1 = CS5490-ISZ: Imported; Built_By: EMA_UL_Team; Vendor: Cirrus Logic; Manufacturer_Part_Number: CS5490-ISZ; RefDes: RefDes; Type: DEV; Value: Value
X1 = ABLS2-4.096MHZ-D4Y-T: as X2 on sheet XBeeLight; Supplier 1: Digi-Key; Manufacturer Part Number: ABLS2-4.096MHZ-D4Y-T; Stock 1: 6062; Pricing 1: 1=0.46, 10=0.385, 50=0.3466, 100=0.308, 500=0.2926 (USD); Frequency: 4.096 MHz; Load Capacitance: 18 pF; Mounting Style: Surface Mount; Operating Temp Range: -40C to 85C; Package / Case: HC-49/US; Packaging: Tape and Reel; Type: Crystal; ComponentLink1URL: http://www.abracon.com/Resonators/ABLS2.pdf; ComponentLink1Description: http://www.abracon.com/Resonators/ABLS2.pdf; ComponentLink2URL: https://abracon.com/Resonators/ABLS2.pdf; ComponentLink2Description: https://abracon.com/Resonators/ABLS2.pdf; ComponentLink3URL: http://www.farnell.com/datasheets/1749648.pdf; ComponentLink3Description: http://www.farnell.com/datasheets/1749648.pdf; Supplier Part Number 1: 535-9858-1-ND
P3-P6 = Plug: LatestRevisionDate: 17-Jul-2002; LatestRevisionNote: Re-released for DXP Platform.; Publisher: Altium Limited

## Nets that join several sheets
3V3: XBeeLight (13 pins), PowerMngt (C17.2), PowerMeasurement (5 pins)
GND: XBeeLight (21 pins), PowerMngt (7 pins), PowerMeasurement (11 pins)
230V: PowerMngt (R15.2), PowerMeasurement (P5.1 Ry1.5)
Neutral: PowerMngt (CR4.1), PowerMeasurement (P6.1 R1.2 R7.1 R11.2)
Relay: XBeeLight (U3.16), PowerMeasurement (Q1.1)
Reset: XBeeLight (U3.19), PowerMeasurement (C1.1 R2.1 U1.3)
RX: XBeeLight (U3.38), PowerMeasurement (U1.14)